# Altium schematic sheet USB_USB2534.SchDoc
size A3; DocumentNumber: 6; SheetNumber: 5; SheetTotal: 7; PostalCode_City: PostalCode_City; Country: Country; Company: Robert BOSCH GmbH; TelefonNumber: TelefonNumber; Street: Street; Department: Department
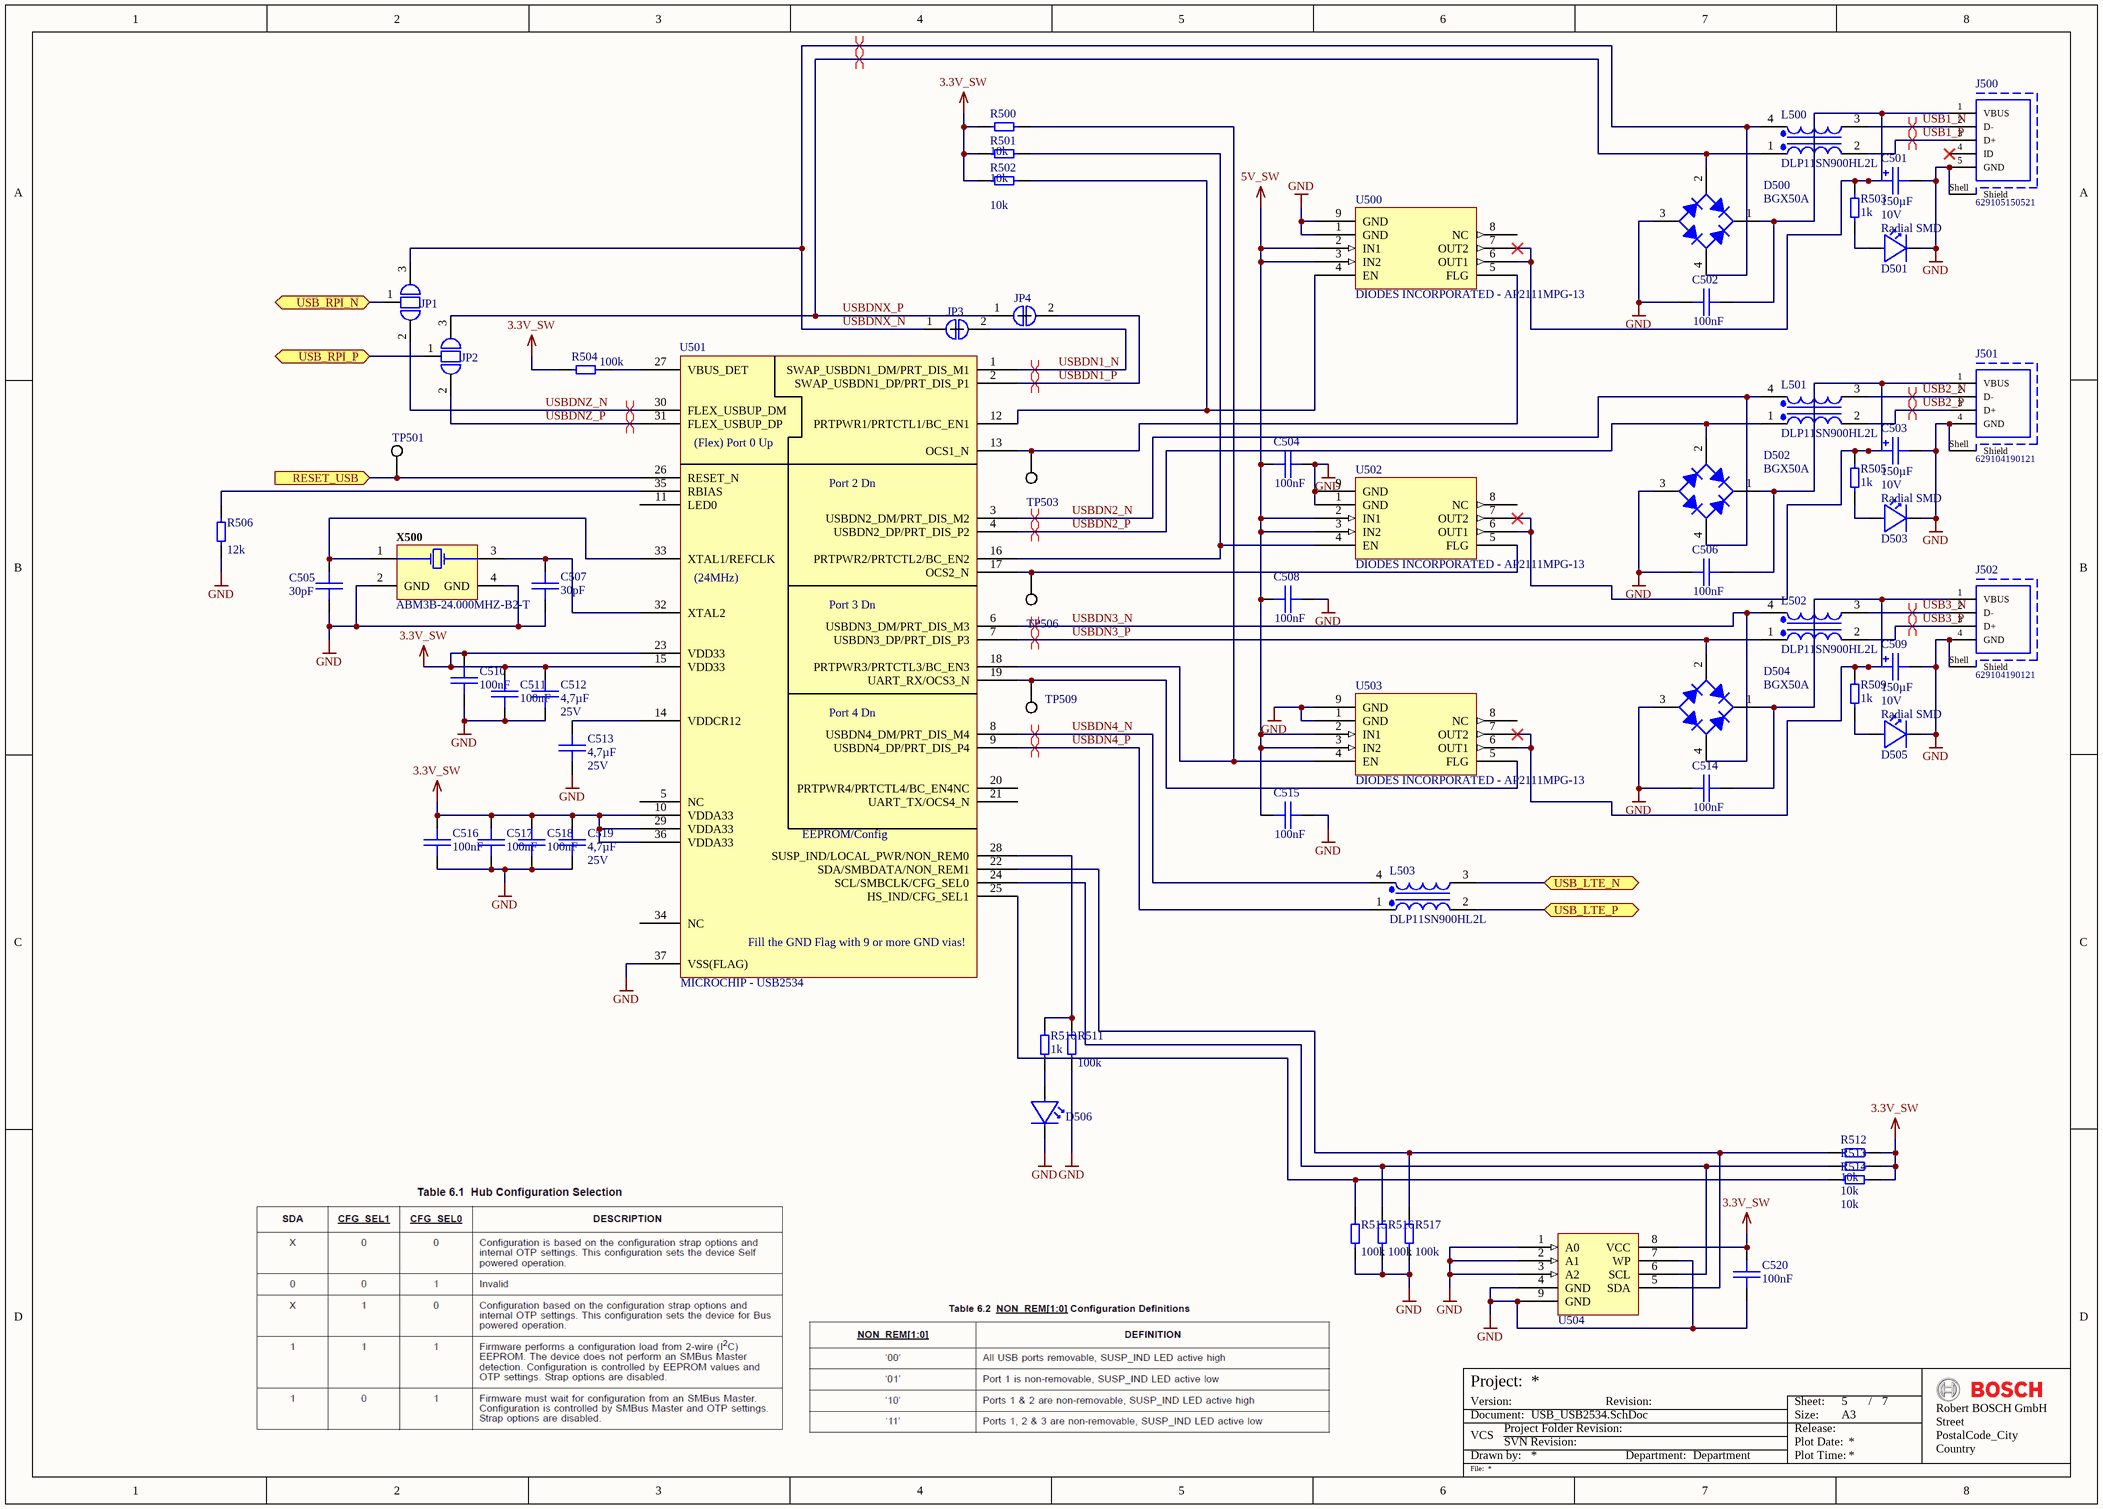
[diagram p0: USB_USB2534.SchDoc]

## Parts
C501  Capacitance: 150µF  Voltage Rating: 10V  Case: Radial SMD  [WCAP-ASLI_6.3x5.5]  (hidden comment: CAP2625 150u -20% +20% 10V)
C502  Capacitance: 100nF  [CAP 0402 [1005 Metric] X050 N]  (hidden comment: CAP 0402 100n -10% +10% 35V X5R)
C503  Capacitance: 150µF  Voltage Rating: 10V  Case: Radial SMD  [WCAP-ASLI_6.3x5.5]  (hidden comment: CAP2625 150u -20% +20% 10V)
C504  Capacitance: 100nF  [CAP 0402 [1005 Metric] X050 N]  (hidden comment: CAP 0402 100n -10% +10% 35V X5R)
C505  Capacitance: 30pF  [CAP 0402 [1005 Metric] X050 N]  (hidden comment: CAP 0402 30p -2% +2% 25V C0G)
C506  Capacitance: 100nF  [CAP 0402 [1005 Metric] X050 N]  (hidden comment: CAP 0402 100n -10% +10% 35V X5R)
C507  Capacitance: 30pF  [CAP 0402 [1005 Metric] X050 N]  (hidden comment: CAP 0402 30p -2% +2% 25V C0G)
C508  Capacitance: 100nF  [CAP 0402 [1005 Metric] X050 N]  (hidden comment: CAP 0402 100n -10% +10% 35V X5R)
C509  Capacitance: 150µF  Voltage Rating: 10V  Case: Radial SMD  [WCAP-ASLI_6.3x5.5]  (hidden comment: CAP2625 150u -20% +20% 10V)
C510  Capacitance: 100nF  [CAP 0402 [1005 Metric] X050 N]  (hidden comment: CAP 0402 100n -10% +10% 35V X5R)
C511  Capacitance: 100nF  [CAP 0402 [1005 Metric] X050 N]  (hidden comment: CAP 0402 100n -10% +10% 35V X5R)
C512  Capacitance: 4,7µF  Voltage Rating: 25V  [CAP 0603 [1608 Metric] X080 N]  (hidden comment: CAP 0603 4u7 -20% +20% 25V X5R)
C513  Capacitance: 4,7µF  Voltage Rating: 25V  [CAP 0603 [1608 Metric] X080 N]  (hidden comment: CAP 0603 4u7 -20% +20% 25V X5R)
C514  Capacitance: 100nF  [CAP 0402 [1005 Metric] X050 N]  (hidden comment: CAP 0402 100n -10% +10% 35V X5R)
C515  Capacitance: 100nF  [CAP 0402 [1005 Metric] X050 N]  (hidden comment: CAP 0402 100n -10% +10% 35V X5R)
C516  Capacitance: 100nF  [CAP 0402 [1005 Metric] X050 N]  (hidden comment: CAP 0402 100n -10% +10% 35V X5R)
C517  Capacitance: 100nF  [CAP 0402 [1005 Metric] X050 N]  (hidden comment: CAP 0402 100n -10% +10% 35V X5R)
C518  Capacitance: 100nF  [CAP 0402 [1005 Metric] X050 N]  (hidden comment: CAP 0402 100n -10% +10% 35V X5R)
C519  Capacitance: 4,7µF  Voltage Rating: 25V  [CAP 0603 [1608 Metric] X080 N]  (hidden comment: CAP 0603 4u7 -20% +20% 25V X5R)
C520  Capacitance: 100nF  [CAP 0402 [1005 Metric] X050 N]  (hidden comment: CAP 0402 100n -10% +10% 35V X5R)
D500  BGX50A  [INF-SOT143_V]
D501  ROHM - SML-P11MT(R)  [ROHM - SML-P11x Series]  (value not drawn)
D502  BGX50A  [INF-SOT143_V]
D503  ROHM - SML-P11MT(R)  [ROHM - SML-P11x Series]  (value not drawn)
D504  BGX50A  [INF-SOT143_V]
D505  ROHM - SML-P11MT(R)  [ROHM - SML-P11x Series]  (value not drawn)
D506  ROHM - SML-P11UT(R)  [ROHM - SML-P11x Series]  (value not drawn)
J500  629105150521  [629105150521]
J501  629104190121  [629104190121]
J502  629104190121  [629104190121]
JP1  Solder Jumper Triple 0402 without Assembly  [Solder Jumper Triple 0402 without Assembly]  (value not drawn)
JP2  Solder Jumper Triple 0402 without Assembly  [Solder Jumper Triple 0402 without Assembly]  (value not drawn)
JP3  Solder Jumper 0402 bestückt  [Solder Jumper 0402 bestückt]  (value not drawn)
JP4  Solder Jumper 0402 bestückt  [Solder Jumper 0402 bestückt]  (value not drawn)
L500  DLP11SN900HL2L  [MURA-1210-4_V]
L501  DLP11SN900HL2L  [MURA-1210-4_V]
L502  DLP11SN900HL2L  [MURA-1210-4_V]
L503  DLP11SN900HL2L  [MURA-1210-4_V]
R500  Resistance: 10k  [RES 0402 [1005 Metric]_N]  (hidden comment: RES 0402 10K 1% 62.5mW)
R501  Resistance: 10k  [RES 0402 [1005 Metric]_N]  (hidden comment: RES 0402 10K 1% 62.5mW)
R502  Resistance: 10k  [RES 0402 [1005 Metric]_N]  (hidden comment: RES 0402 10K 1% 62.5mW)
R503  Resistance: 1k  [RES 0402 [1005 Metric]_N]  (hidden comment: RES 0402 1K 1% 62.5mW)
R504  Resistance: 100k  [RES 0402 [1005 Metric]_N]  (hidden comment: RES 0402 100K 1% 62.5mW)
R505  Resistance: 1k  [RES 0402 [1005 Metric]_N]  (hidden comment: RES 0402 1K 1% 62.5mW)
R506  Resistance: 12k  [RES 0402 [1005 Metric] L]  (hidden comment: RES 0402 12K 1% 62.5mW)
R509  Resistance: 1k  [RES 0402 [1005 Metric]_N]  (hidden comment: RES 0402 1K 1% 62.5mW)
R510  Resistance: 1k  [RES 0402 [1005 Metric]_N]  (hidden comment: RES 0402 1K 1% 62.5mW)
R511  Resistance: 100k  [RES 0402 [1005 Metric]_N]  (hidden comment: RES 0402 100K 1% 62.5mW)
R512  Resistance: 10k  [RES 0402 [1005 Metric]_N]  (hidden comment: RES 0402 10K 1% 62.5mW)
R513  Resistance: 10k  [RES 0402 [1005 Metric]_N]  (hidden comment: RES 0402 10K 1% 62.5mW)
R514  Resistance: 10k  [RES 0402 [1005 Metric]_N]  (hidden comment: RES 0402 10K 1% 62.5mW)
R515  Resistance: 100k  [RES 0402 [1005 Metric]_N]  (hidden comment: RES 0402 100K 1% 62.5mW)
R516  Resistance: 100k  [RES 0402 [1005 Metric]_N]  (hidden comment: RES 0402 100K 1% 62.5mW)
R517  Resistance: 100k  [RES 0402 [1005 Metric]_N]  (hidden comment: RES 0402 100K 1% 62.5mW)
TP501  Testpad, 1.0mm x 1.0mm, round  [Testpad, 1.0mm x 1.0mm, round]  (value not drawn)  (no BOM)
TP503  Testpad, 1.0mm x 1.0mm, round  [Testpad, 1.0mm x 1.0mm, round]  (value not drawn)  (no BOM)
TP506  Testpad, 1.0mm x 1.0mm, round  [Testpad, 1.0mm x 1.0mm, round]  (value not drawn)  (no BOM)
TP509  Testpad, 1.0mm x 1.0mm, round  [Testpad, 1.0mm x 1.0mm, round]  (value not drawn)  (no BOM)
U500  DIODES INCORPORATED - AP2111MPG-13  [TSOP65P490X110_HS-9N]
U501  MICROCHIP - USB2534  [QFN50P600X600X100_HS-37N]
U502  DIODES INCORPORATED - AP2111MPG-13  [TSOP65P490X110_HS-9N]
U503  DIODES INCORPORATED - AP2111MPG-13  [TSOP65P490X110_HS-9N]
U504  MICROCHIP - AT24C04BN-SH-T  [SON50P200X60_HS-9N]  (value not drawn)
X500  ABM3B-24.000MHZ-B2-T  [ABRA-ABM3B-4_V]

## Ports
RESET_USB (in), USB_LTE_N (bidir), USB_LTE_P (bidir), USB_RPI_N (bidir), USB_RPI_P (bidir)

## Nets
3.3V_SW: C510.1 C511.1 C512.2 C516.1 C517.1 C518.1 C519.2 C520.1 R500.1 R501.1 R502.1 R504.1 R512.2 R513.2 R514.2 U501.10(VDDA33) U501.15(VDD33) U501.23(VDD33) U501.29(VDDA33) U501.36(VDDA33) U504.8(VCC)
5V_SW: C504.2 C508.2 C515.2 U500.2(IN1) U500.3(IN2) U502.2(IN1) U502.3(IN2) U503.2(IN1) U503.3(IN2)
GND: C501.2 C502.2 C503.2 C504.1 C505.2 C506.2 C507.2 C508.1 C509.2 C510.2 C511.2 C512.1 C513.1 C514.2 C515.1 C516.2 C517.2 C518.2 C519.1 C520.2 D500.3(A) D501.C D502.3(A) D503.C D504.3(A) D505.C D506.C J500.5(GND) J500.Shell(Shield) J501.4(GND) J501.Shell(Shield) J502.4(GND) J502.Shell(Shield) R506.1 R511.1 R515.1 R516.1 R517.1 U500.1(GND) U500.9(GND) U501.37(VSS(FLAG)) U502.1(GND) U502.9(GND) U503.1(GND) U503.9(GND) U504.1(A0) U504.2(A1) U504.3(A2) U504.4(GND) U504.7(WP) U504.9(GND) X500.2(GND) X500.4(GND)
RESET_USB: TP501.1 U501.26(RESET_N) ; port RESET_USB
USB1_N: J500.2(D-) L500.3
USB1_P: J500.3(D+) L500.2
USB2_N: J501.2(D-) L501.3
USB2_P: J501.3(D+) L501.2
USB3_N: J502.2(D-) L502.3
USB3_P: J502.3(D+) L502.2
USB_LTE_N: L503.3 ; port USB_LTE_N
USB_LTE_P: L503.2 ; port USB_LTE_P
USB_RPI_N: JP1.1 ; port USB_RPI_N
USB_RPI_P: JP2.1 ; port USB_RPI_P
USBDN1_N: JP3.2 U501.1(SWAP_USBDN1_DM/PRT_DIS_M1)
USBDN1_P: JP4.2 U501.2(SWAP_USBDN1_DP/PRT_DIS_P1)
USBDN2_N: D502.4(C) L501.4 U501.3(USBDN2_DM/PRT_DIS_M2)
USBDN2_P: D502.2(C) L501.1 U501.4(USBDN2_DP/PRT_DIS_P2)
USBDN3_N: D504.4(C) L502.4 U501.6(USBDN3_DM/PRT_DIS_M3)
USBDN3_P: D504.2(C) L502.1 U501.7(USBDN3_DP/PRT_DIS_P3)
USBDN4_N: L503.4 U501.8(USBDN4_DM/PRT_DIS_M4)
USBDN4_P: L503.1 U501.9(USBDN4_DP/PRT_DIS_P4)
USBDNX_N: D500.4(C) JP1.3 JP3.1 L500.4
USBDNX_P: D500.2(C) JP2.3 JP4.1 L500.1
USBDNZ_N: JP1.2 U501.30(FLEX_USBUP_DM)
USBDNZ_P: JP2.2 U501.31(FLEX_USBUP_DP)
NetC501_1: C501.1 C502.1 D500.1(K) J500.1(VBUS) R503.1 U500.6(OUT1) U500.7(OUT2)
NetC503_1: C503.1 C506.1 D502.1(K) J501.1(VBUS) R505.1 U502.6(OUT1) U502.7(OUT2)
NetC505_1: C505.1 U501.33(XTAL1/REFCLK) X500.1(X1)
NetC507_1: C507.1 U501.32(XTAL2) X500.3(X2)
NetC509_1: C509.1 C514.1 D504.1(K) J502.1(VBUS) R509.1 U503.6(OUT1) U503.7(OUT2)
NetC513_2: C513.2 U501.14(VDDCR12)
NetD501_A: D501.A R503.2
NetD503_A: D503.A R505.2
NetD505_A: D505.A R509.2
NetD506_A: D506.A R510.1
NetR500_2: R500.2 U501.18(PRTPWR3/PRTCTL3/BC_EN3) U503.4(EN)
NetR501_2: R501.2 U501.16(PRTPWR2/PRTCTL2/BC_EN2) U502.4(EN)
NetR502_2: R502.2 U500.4(EN) U501.12(PRTPWR1/PRTCTL1/BC_EN1)
NetR504_2: R504.2 U501.27(VBUS_DET)
NetR506_2: R506.2 U501.35(RBIAS)
NetR510_2: R510.2 R511.2 U501.28(SUSP_IND/LOCAL_PWR/NON_REM0)
NetR512_1: R512.1 R517.2 U501.22(SDA/SMBDATA/NON_REM1) U504.5(SDA)
NetR513_1: R513.1 R516.2 U501.24(SCL/SMBCLK/CFG_SEL0) U504.6(SCL)
NetR514_1: R514.1 R515.2 U501.25(HS_IND/CFG_SEL1)
NetTP503_1: TP503.1 U500.5(FLG) U501.13(OCS1_N)
NetTP506_1: TP506.1 U501.17(OCS2_N) U502.5(FLG)
NetTP509_1: TP509.1 U501.19(UART_RX/OCS3_N) U503.5(FLG)

Not connected (* = marked no-connect by the designer): J500 4(ID)*; U500 8(NC); U501 5(NC) 11(LED0) 20(PRTPWR4/PRTCTL4/BC_EN4NC) 21(UART_TX/OCS4_N) 34(NC); U502 8(NC); U503 8(NC)

## Layout directives
differential pair; differential pair class DIFF90: USB1_N, USB1_P, USB2_N, USB2_P, USB3_N, USB3_P, USBDN1_N, USBDN1_P, USBDN2_N, USBDN2_P, USBDN3_N, USBDN3_P, USBDN4_N, USBDN4_P, USBDNX_N, USBDNX_P, USBDNZ_N, USBDNZ_P

## Notes on the sheet
- Project:
- Document:
- Drawn by:
- VCS
- Version:
- Project Folder Revision:
- SVN Revision:
- Revision:
- Department:
- Plot Date:
- Size:
- Sheet:
- Plot Time:
- Release:
- A3
- /
- File:
- (in symbol CMP-06097-6) (Flex) Port 0 Up; Port 2 Dn; (24MHz); Port 3 Dn; Port 4 Dn; EEPROM/Config; Fill the GND Flag with 9 or more GND vias!

## Library data of the parts
C501 C503 C509 = CMP-04590-3: WCAP-ASLL Aluminium Electrolytic Capacitor (SMD Type): -55°C to 105°, Reflow Soldering, Low Impedance; Manufacturer: WUERTH ELEKTRONIK; Manufacturer Part Number: 865060243005; Ripple Frequency: 100kHz; Value: 150µF; Assembly: yes; Capacitance Tolerance pos: 20%; Impedance: 0.44; Ripple Current max: 250mA; Leak Current: 15µA; Capacitance Tolerance neg: -20%; ComponentLink1Description: Datasheet; ComponentLink1URL: http://katalog.we-online.de/pbs/datasheet/865060243005.pdf; Mounting Type: SMT; Operating Temperature max: 105°C; Operating Temperature min: -55°C
C502 C504 C506 C508 C510 C511 C514-C518 C520 = CMP-06091-1: SMD/SMT 0402 35V -10% +10% X5R - Multilayer Ceramic Capacitors MLCC; Manufacturer: TDK; Manufacturer Part Number: C1005X5R1V104K050BB; Assembly: yes; Value: 100nF; Capacitance Tolerance pos: 10%; Case: 0402 [1005]; ComponentLink1Description: Datasheet; ComponentLink1URL: https://de.farnell.com/tdk/c1005x5r1v104k050bb/kondensator-0-1-f-35v-10-x5r-0402/dp/2528760?st=100n%200402%2035v; Dielectric Type: X5R; IPC Footprint Naming: CAPC1005X050; Mounting Type: SMT; Operating Temperature max: 85°C; Operating Temperature min: -55°C; Voltage Rating: 35V; Capacitance Tolerance neg: -10%
C505 C507 = CMP-03847-2: SMD/SMT 0402 25V -2% +2% C0G - Multilayer Ceramic Capacitors MLCC; Manufacturer: MURATA; Manufacturer Part Number: GRM1555C1E300GA01#; Assembly: yes; Capacitance Tolerance pos: 2%; Value: 30pF; Capacitance Tolerance neg: -2%; Case: 0402 [1005]; ComponentLink1URL: http://psearch.en.murata.com/capacitor/lineup/grm/; Dielectric Type: C0G; IPC Footprint Naming: CAPC1005X050; ComponentLink1Description: Datasheet; Mounting Type: SMT; Operating Temperature max: 125°C; Operating Temperature min: -55°C; Voltage Rating: 25V
C512 C513 C519 = CMP-05102-1: SMD/SMT 0603 25V -20% +20% X5R - Multilayer Ceramic Capacitors MLCC; Manufacturer: TDK; Manufacturer Part Number: C1608X5R1E475M080AC; Assembly: yes; Capacitance Tolerance pos: 20%; Value: 4,7µF; ItemHRID: CMP-03365; RevisionId: 2; AccessRights: 15; Folder: 10 Library\Component Library\Passive Components\Capacitors\Ceramic Capacitors\; ContentType: Component; Capacitance Tolerance neg: -20%; Case: 0603 [1608]; ComponentLink1Description: Datasheet; ComponentLink1URL: http://www.farnell.com/datasheets/2291921.pdf; Dielectric Type: X5R; IPC Footprint Naming: CAPC1608X080; Mounting Type: SMT; Operating Temperature max: 85°C; Operating Temperature min: -55°C; ReleaseDate: 20/01/2017 12:59:13 PM; ComponentType: Ceramic Capacitor; FolderGUID: 1B932E09-F2A4-48AF-86E9-372599342254; LifeCycle: In Design; AncestorItemRevisionGUID: E51D455D-F8A1-44A6-8671-03D7555E002A; LifeCycleStateGUID: E3052186-9469-4B71-ADAB-0D319103D948; ContentTypeGUID: CB3C11C4-E317-11DF-B822-12313F0024A2; ItemGUID: 2606C917-888A-4062-919A-A6B1386C23AD
D500 D502 D504 = CMP-1188-00003-1: Silicon Switching Diode Array, SOT143-4-1, Reel, Green; Manufacturer: Infineon; VR (max): 50Â V; IR (max): 0.2Â uA; VF (max): 1.3Â V; trr (max): 6Â ns; Green: TRUE; Configuration: Bridge; IF (max): 140Â mA; PartNumber: BGX50A; PackageReference: SOT143; ComponentLink3Description: Package Specification; ComponentLink2Description: Datasheet; ComponentLink1URL: http://www.infineon.com/; Mounting Technology: Surface Mount; ComponentLink2URL: http://www.infineon.com/dgdl/bgx50aseries.pdf?folderId=db3a30431400ef6801141cc1c4cd04e8&fileId=db3a30431400ef6801141cc423c404e9; ComponentLink1Description: Manufacturer URL; ComponentLink3URL: http://www.infineon.com/dgdl/SOT143-Package_Overview.pdf?folderId=db3a30431936bc4b011952ce8b1b3bed&fileId=db3a30431936bc4b011952df42203c0c; PackageDescription: 4-Pin Small Outline Transistor Package, 1.3 x 2.9 mm Body
D501 D503 D505 = CMP-06096-1: Standard LEDs - SMD Yellowish Green 569nm 2.1mcd 50mW Pd 1.9V Vf; Assembly: yes; Forward Current LED1: 20mA; Forward Voltage LED1: 1,9V; Reverse Voltage LED1: 5V; Case: 0402; Colour LED1: yellowish green; ComponentLink1Description: Datahseet; ComponentLink1URL: https://d1d2qsbl8m0m72.cloudfront.net/en/products/databook/datasheet/opto/led/chip_mono/sml-p11-e.pdf; Luminous Intensity LED1: 2.1mcd; Manufacturer: ROHM; Manufacturer Part Number: SML-P11MT(R); Mounting Type: SMT; Operating Temperature max: 85°C; Operating Temperature min: -40°C; Wavelength LED1: 569nm
D506 = CMP-06093-1: Standard LEDs - SMD Red 621nm 2.5mcd 50mW Pd 1.8V Vf; Assembly: yes; Forward Current LED1: 20mA; Reverse Voltage LED1: 5V; Case: 0402; Colour LED1: red; ComponentLink1Description: Datahseet; ComponentLink1URL: https://d1d2qsbl8m0m72.cloudfront.net/en/products/databook/datasheet/opto/led/chip_mono/sml-p11-e.pdf; Forward Voltage LED1: 1.8V; Luminous Intensity LED1: 2.5mcd; Manufacturer: ROHM; Manufacturer Part Number: SML-P11UT(R); Mounting Type: SMT; Operating Temperature max: 85°C; Operating Temperature min: -40°C; Wavelength LED1: 621nm
J500 = CMP-1502-03252-1: Micro USB 2.0 Type B Receptacle WR-COM, Horizontal, SMT, with Pegs, High Current at Pin 1 & Pin 5; Manufacturer: Wurth Elektronik; Contact Resistance: 30mOhm; Rated Current: 3A; Working Voltage: 30VAC; Package Reference: 629105150521; Mounting Technology: SMT; Connector Type: MicroUSB2.0TypeB; Operating Temperature: -40to85degC; Orientation: Horizontal; Manufacturer URL: http://www.we-online.de; Datasheet URL: https://katalog.we-online.de/em/datasheet/629105150521.pdf; Part Number: 629105150521; Packaging: TapeandReel; Gender: Receptacle; Publisher: WurthElektronik
J501 J502 = CMP-1502-03232-1: USB 2.0 Type A Receptacle WR-COM, Horizontal, SMT, Short Type with Pads and Pegs; Manufacturer: Wurth Elektronik; Contact Resistance: 30mOhm; Rated Current: 1.5A; Working Voltage: 30VAC; Orientation: Horizontal; Package Reference: 629104190121; Connector Type: USB2.0TypeA; Operating Temperature: -40to85degC; Publisher: WurthElektronik; Manufacturer URL: http://www.we-online.de; Mounting Technology: SMT; Packaging: TapeandReel; Datasheet URL: https://katalog.we-online.de/em/datasheet/629104190121.pdf; Part Number: 629104190121; Gender: Receptacle
JP1 JP2 = CMP-00156-12: Assembly: no; Case: 0402 Triple; ComponentLink1Description: Datasheet; Manufacturer: -; Manufacturer Part Number: -; Operating Temperature max: 0°C; Operating Temperature min: 0°C; Mounting Type: SMT
JP3 JP4 = CMP-04663-3: Manufacturer: YAGEO; Manufacturer Part Number: RC0402JR-070RL; Assembly: yes; Case: 0402; ComponentLink1Description: Datasheet; ComponentLink1URL: http://docs-europe.electrocomponents.com/webdocs/13ec/0900766b813ecb03.pdf; Mounting Type: SMT; Operating Temperature max: 155°C; Operating Temperature min: -55°C
L500-L503 = CMP-2000-06161-1: Chip Common Mode Choke Coil, 1.5 Ohm, 150 mA, -40 to 85 degC, 4-Pin SMD (1210), RoHS, Tape and Reel; Manufacturer: MurataElectronics; Impedance: 90Ohm; Product Depth: 1mm; Manufacturer URL: http://www.murata.com/; Package/Case: 0504; Datasheet Version: 07/2015; Category: InductorSurfaceMount; Type: CommonMode; Package Reference: 1210; Datasheet URL: http://datasheet.octopart.com/DLP11SN900HL2L-Murata-datasheet-62086405.pdf; Package Description: 4-Pin Surface Mount Device, Body 1.25 x 1 mm, Pitch 0.55 mm; Mounting Technology: SurfaceMount
R500-R502 R512-R514 = CMP-00958-3: RC0402 series chip resistor with lead-free terminations made by thick film process; Manufacturer: YAGEO; Manufacturer Part Number: RC0402FR-0710KL; Assembly: yes; Current Rating: 1A; Power Rating: 62,5mW; Temperature Coefficient: ±100ppm/K; Voltage Rating: 50V; Case: 0402 [1005]; ComponentLink1Description: Datasheet; ComponentLink1URL: http://www.yageo.com/documents/recent/PYu-RC0402_51_RoHS_L_6.pdf; IPC Footprint Naming: RESC1005X04; Mounting Type: SMT; Operating Temperature max: 155°C; Operating Temperature min: -55°C; Resistance Tolerance: 1%; Resistor Element Type: Thick Film; Value: 10k
R503 R505 R509 R510 = CMP-00843-3: RC0402 series chip resistor with lead-free terminations made by thick film process; Manufacturer Part Number: RC0402FR-071KL; Manufacturer: YAGEO; Power Rating: 62,5mW; Temperature Coefficient: ±100ppm/K; Voltage Rating: 50V; Assembly: yes; Current Rating: 1A; Mounting Type: SMT; Operating Temperature max: 155°C; Operating Temperature min: -55°C; Resistance Tolerance: 1%; Resistor Element Type: Thick Film; Value: 1k; Case: 0402 [1005]; ComponentLink1Description: Datasheet; ComponentLink1URL: http://www.yageo.com/documents/recent/PYu-RC0402_51_RoHS_L_6.pdf; IPC Footprint Naming: RESC1005X04
R504 R511 R515-R517 = CMP-01074-3: RC0402 series chip resistor with lead-free terminations made by thick film process; Manufacturer: YAGEO; Manufacturer Part Number: RC0402FR-07100KL; Assembly: yes; Current Rating: 1A; Power Rating: 62,5mW; Temperature Coefficient: ±100ppm/K; Voltage Rating: 50V; Case: 0402 [1005]; ComponentLink1Description: Datasheet; ComponentLink1URL: http://www.yageo.com/documents/recent/PYu-RC0402_51_RoHS_L_6.pdf; IPC Footprint Naming: RESC1005X04; Mounting Type: SMT; Operating Temperature max: 155°C; Operating Temperature min: -55°C; Resistance Tolerance: 1%; Resistor Element Type: Thick Film; Value: 100k
R506 = CMP-00966-3: RC0402 series chip resistor with lead-free terminations made by thick film process; Manufacturer: YAGEO; Manufacturer Part Number: RC0402FR-0712KL; Current Rating: 1A; Assembly: yes; Power Rating: 62,5mW; Temperature Coefficient: ±100ppm/K; Voltage Rating: 50V; Case: 0402 [1005]; ComponentLink1Description: Datasheet; ComponentLink1URL: http://www.yageo.com/documents/recent/PYu-RC0402_51_RoHS_L_6.pdf; IPC Footprint Naming: RESC1005X04; Mounting Type: SMT; Operating Temperature max: 155°C; Operating Temperature min: -55°C; Resistance Tolerance: 1%; Resistor Element Type: Thick Film; Value: 12k
TP501 TP503 TP506 TP509 = CMP-04511-8: Assembly: no; Case: 1.0x1.0mm, round
U500 U502 U503 = CMP-06137-5: 2A SINGLE CHANNEL CURR / ENT-LIMITED POWER SWITCH, high-side power switch for USB; Assembly: yes; Input Voltage max: 6.5V; Input Voltage min: 2.7V; Output Voltage max: 5.5V; Output Voltage min: 1.6V; No. of Outputs: 1; Case: MSOP-8EP; ComponentLink1Description: Datasheet; ComponentLink1URL: https://www.diodes.com/assets/Datasheets/AP2101_2111.pdf; Manufacturer: DIODES INCORPORATED; Manufacturer Part Number: AP2111MPG-13; Mounting Type: SMT; Operating Temperature max: 85°C; Operating Temperature min: -35°C; Output Current max: 2A
U501 = CMP-06097-6: The USB2534 is a low-power, OEM configurable, MTT (Multi-Transaction Translator) USB 2.0 hub controller with 4 downstream ports and advanced features for embedded USB applications.; Assembly: yes; Interface Type: HUB-IC; No. of USB Ports: 4; Supply Voltage max: 3.3V; USB Speed Modes: 480Mb/s; USB Version: 2.0; Case: SQFN; ComponentLink1Description: Manufacturer Link; ComponentLink1URL: https://www.microchip.com/wwwproducts/en/USB2534; Data Rate max: -; Manufacturer: MICROCHIP; Manufacturer Part Number: USB2534; Mounting Type: SMT; Operating Temperature max: 85°C; Operating Temperature min: -40°C; Supply Voltage min: 3.3V
U504 = CMP-06143-4: The AT24C04B/08B provides 4096/8192 bits of serial electrically erasable and programmable read-only memory (EEPROM) organized as 512/1024 words of 8 bits each.; Manufacturer Part Number: AT24C08C; Assembly: yes; Clock Frequency max: 1MHz; Supply Voltage max: 5.5V; Supply Voltage min: 4.5V; Case: 8Y6; ComponentLink1Description: Datasheet; ComponentLink1URL: http://ww1.microchip.com/downloads/en/devicedoc/doc5226.pdf; Manufacturer: MICROCHIP; Memory Configuration: 512/1024 words of 8 bits; Memory Size: 8192 bits; Mounting Type: SMT; Operating Temperature max: 125°C; Operating Temperature min: -55°C
X500 = CMP-1688-00008-1: Ceramic SMD Crystal, 24 MHz, +/- 20 ppm, 50 Ohm, -20 to 70 degC, 4-Pin SMD, RoHS, Tape and Reel; Impedance: 50 Ohm; Mating Cycles: 30; Frequency: 6 Hz; Contact Material: Brass; Contact Plating: Gold; PackageReference: ABM3B; Min Operating Temperature: -40 degC; ComponentLink2Description: Datasheet; Radiation Hardening: No; DatasheetVersion: Aug-15; Packaging: Tape and Reel; Length: 2.6 mm; Package Quantity: 2500; REACH SVHC: Unknown; PackageDescription: 4-Pin Surface Mount Device, Body 5 x 3.2 mm; Weight: 0.001058 oz; ComponentLink2URL: http://www.abracon.com/Resonators/abm3b.pdf; ComponentLink1Description: Manufacturer URL; Width: 3 mm; RoHSCompliant: true; Fastening Type: Snap; Max Operating Temperature: 155 degC; ComponentLink1URL: http://www.abracon.com/; Height: 1.244 mm; Mount: Surface Mount